# EAGLE design TPS61200 (EAGLE 7.1.0)
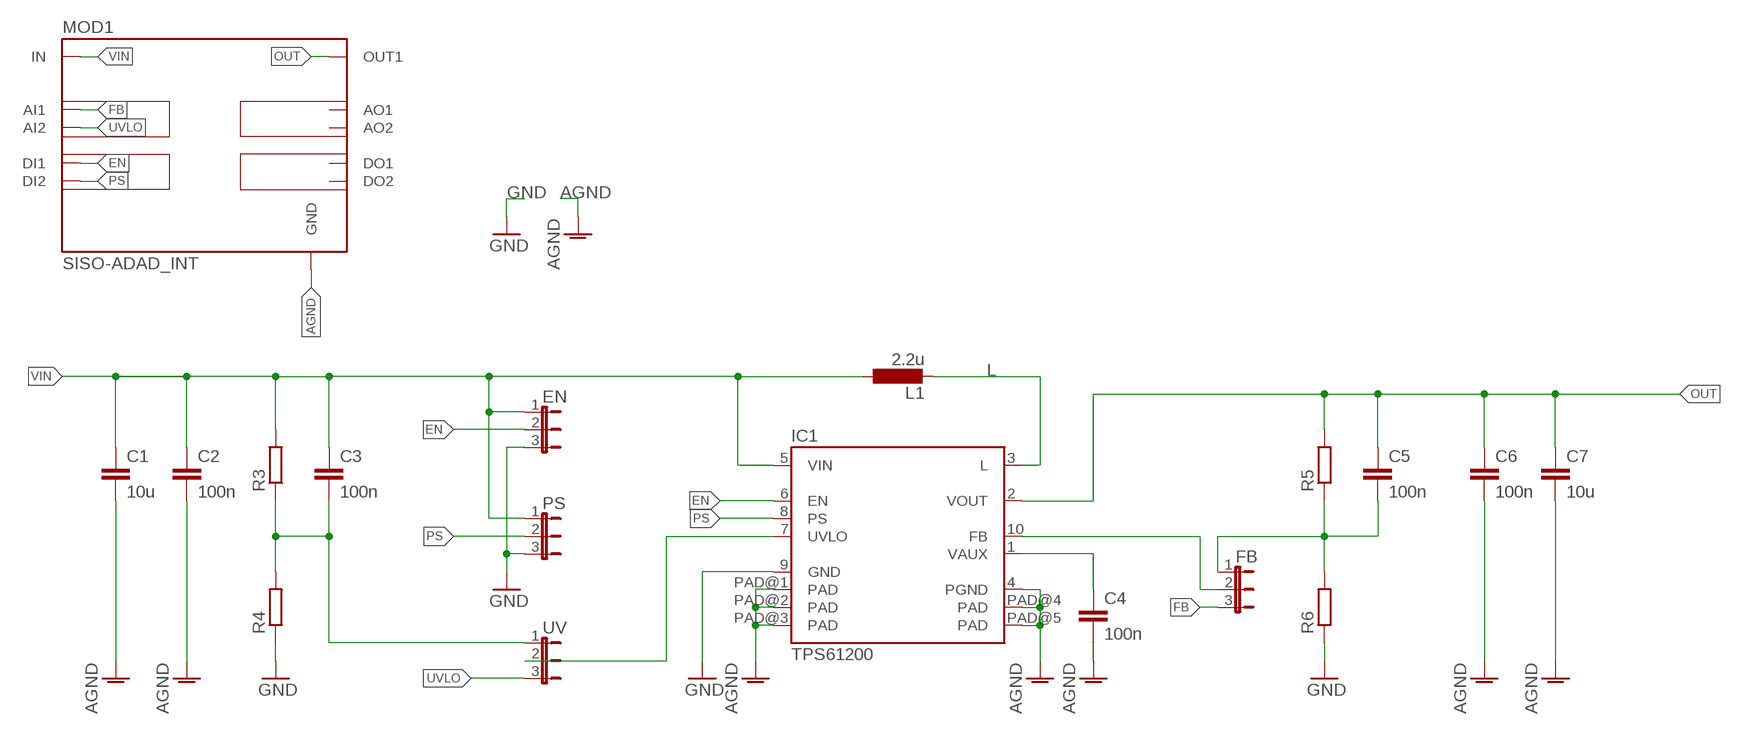
[diagram p0: schematic, sheet 1]

## Parts
C1  10u  C-EUC0805  [C0805]
C2  100n  C-EUC0805  [C0805]
C3  100n  C-EUC0805  [C0805]
C4  100n  C-EUC0805  [C0805]
C5  100n  C-EUC0805  [C0805]
C6  100n  C-EUC0805  [C0805]
C7  10u  C-EUC0805  [C0805]
EN  JP2E  [JP2]
FB  JP2E  [JP2]
IC1  TPS61200  [QFN_10_PAD]
L1  2.2u  L-EUL4035M  [L4035M]
MOD1  SISO-ADAD_INT  [SISO-ADAD]
PS  JP2E  [JP2]
R3  R-EU_R0805  [R0805]
R4  R-EU_R0805  [R0805]
R5  R-EU_R0805  [R0805]
R6  R-EU_R0805  [R0805]
UV  JP2E  [JP2]

## Nets
AGND: C1.2 C2.2 C4.2 C6.2 C7.2 IC1.4(PGND) IC1.PAD@1(PAD) IC1.PAD@2(PAD) IC1.PAD@3(PAD) IC1.PAD@4(PAD) IC1.PAD@5(PAD) MOD1.GND1(GND) MOD1.GND2(GND) MOD1.GND3(GND) MOD1.GND4(GND)
EN: EN.2 IC1.6(EN) MOD1.DI1
FB: FB.3 MOD1.AI1
GND: EN.3 IC1.9(GND) PS.3 R4.1 R6.1
L: IC1.3(L) L1.2
N$1: IC1.7(UVLO) UV.2
N$2: C5.2 FB.1 R5.1 R6.2
N$3: C3.2 R3.1 R4.2 UV.1
N$4: C4.1 IC1.1(VAUX)
N$7: FB.2 IC1.10(FB)
OUT: C5.1 C6.1 C7.1 IC1.2(VOUT) MOD1.OUT1_1(OUT1) MOD1.OUT1_2(OUT1) MOD1.OUT1_3(OUT1) MOD1.OUT1_4(OUT1) R5.2
PS: IC1.8(PS) MOD1.DI2 PS.2
UVLO: MOD1.AI2 UV.3
VIN: C1.1 C2.1 C3.1 EN.1 IC1.5(VIN) L1.1 MOD1.IN1(IN) MOD1.IN2(IN) MOD1.IN3(IN) MOD1.IN4(IN) PS.1 R3.2
Unconnected: MOD1.AO1 MOD1.AO2 MOD1.DO1 MOD1.DO2

## Library data of the parts
C1-C7 = rcl:C-EU: CAPACITOR, European symbol
EN FB PS UV = Jumper_mod:JP2E: JUMPER
IC1 = TPS61200:TPS61200
L1 = rcl:L-EU: INDUCTOR, European symbol
MOD1 = AllModules:SISO-ADAD_INT
R3-R6 = rcl:R-EU_: RESISTOR, European symbol

## Board
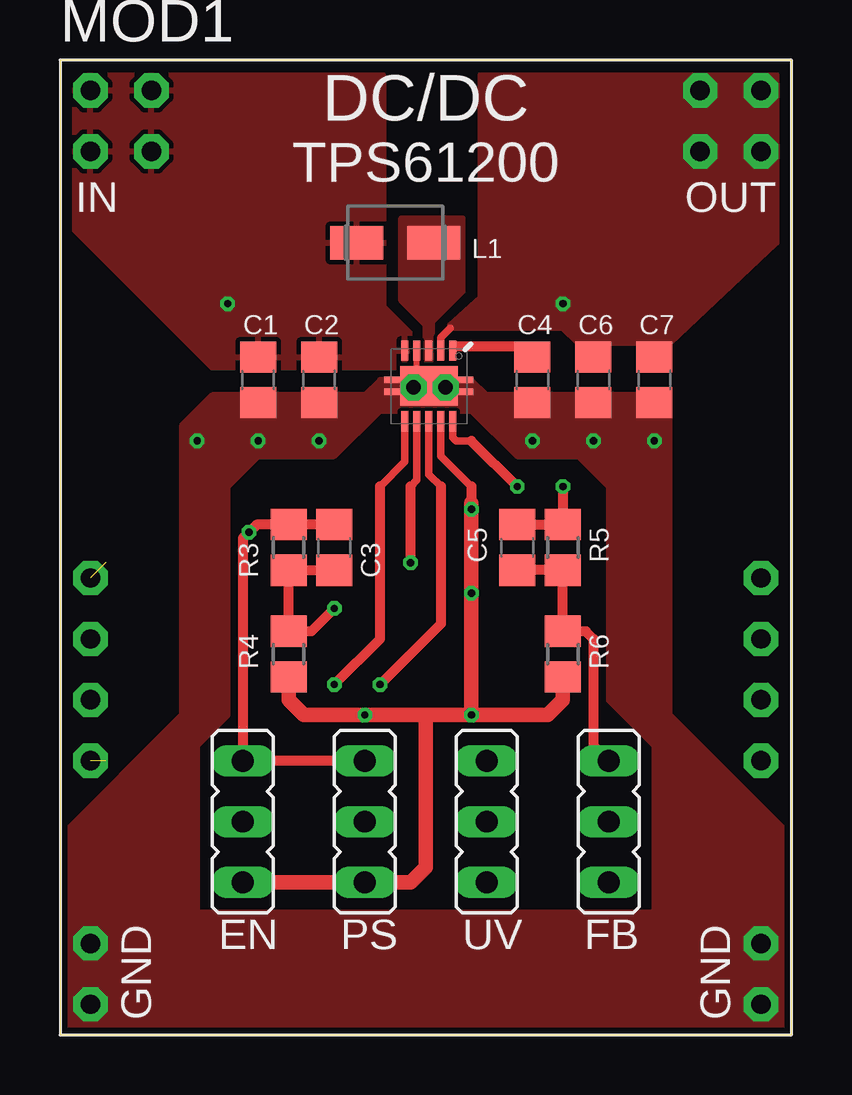
[diagram p1: board, top side]
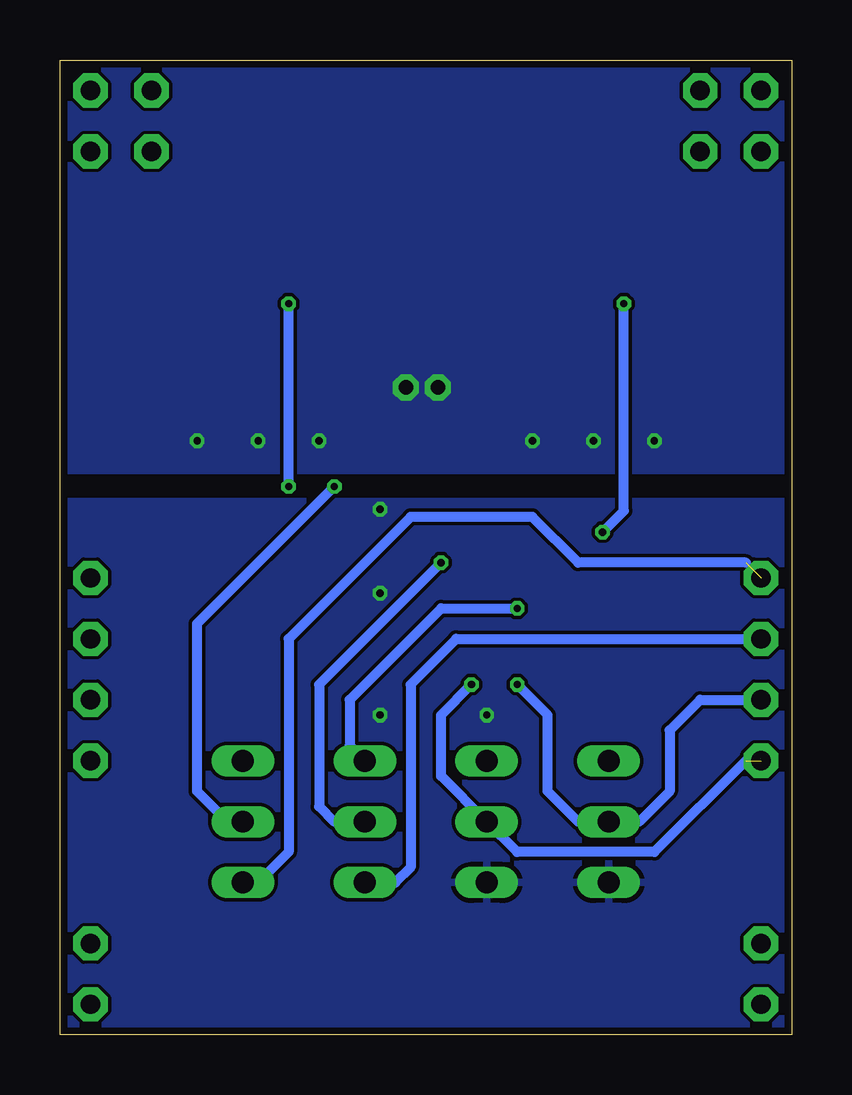
[diagram p2: board, bottom side, seen from below]

Size 30.48 x 40.64 mm. Coordinates in mm from the lower left corner, seen from the top.
Outline: 0,0 30.48,0 30.48,40.64 0,40.64 0,0
Copper layers (1*16): Top 0.035mm / dielectric 1.5mm / Bottom 0.035mm
Design rules "PCB-POOL Standard": minimum track width 0.15mm, minimum drill 0.3mm, track to track 0.15mm, track to pad 0.15mm, pad to pad 0.15mm, via to via 0.15mm, smd to smd 0.15mm, copper to edge 0.3mm, drill to drill 0.2mm, minimum pad ring 0.2mm, minimum via ring 0.15mm, stop-mask expansion 0.075mm, vias tented up to drill 0mil, thermal gap 0.2mm

### Footprints (pad centres in the part's own frame; a part is rotated, then mirrored left to right if it is on the bottom)
C0805 = smd 1.3 x 1.5: 1 -0.95,0; 2 0.95,0
JP2 = drill 0.914 long: 1 -2.54,0; 2 0,0; 3 2.54,0
QFN_10_PAD = smd 0.297 x 0.85: 1 -1,-1.475; 2 -0.5,-1.475; 3 0,-1.475; 4 0.5,-1.475; 5 1,-1.475; 6 1,1.475; 7 0.5,1.475; 8 0,1.475; 9 -0.5,1.475; 10 -1,1.475 | smd 2.4 x 1.65: PAD@1 0,0 | smd 0.7 x 0.28: PAD@2 -1.5,0.25; PAD@3 -1.5,-0.25; PAD@4 1.5,0.25; PAD@5 1.5,-0.25
L4035M = smd 2.2 x 1.4: 1 -1.6,0; 2 1.6,0
SISO-ADAD = drill 0.8 pad 1.422 octagon: AI1 0,-20.32; AI2 0,-22.86; AO1 27.94,-20.32; AO2 27.94,-22.86; DI1 0,-25.4; DI2 0,-27.94; DO1 27.94,-25.4; DO2 27.94,-27.94; GND1 0,-38.1; GND2 0,-35.56; GND3 27.94,-35.56; GND4 27.94,-38.1; IN1 0,0; IN2 0,-2.54; IN3 2.54,0; IN4 2.54,-2.54; OUT1_1 27.94,0; OUT1_2 27.94,-2.54; OUT1_3 25.4,0; OUT1_4 25.4,-2.54
R0805 = smd 1.3 x 1.5: 1 -0.95,0; 2 0.95,0

### Placement (x,y rotation side)
C1  8.26,27.3 270 top
C2  10.79,27.3 270 top
C3  11.43,20.32 270 top
C4  19.68,27.3 270 top
C5  19.05,20.32 270 top
C6  22.23,27.3 270 top
C7  24.77,27.3 270 top
EN  7.62,8.89 270 top
FB  22.86,8.89 270 top
IC1  15.37,27.05 180 top
L1  13.97,33.02 0 top
MOD1  1.27,39.37 0 top
PS  12.7,8.89 270 top
R3  9.53,20.32 90 top
R4  9.53,15.88 90 top
R5  20.95,20.32 90 top
R6  20.95,15.88 90 top
UV  17.78,8.89 270 top

### Tracks (layer width: path | path; a pad name or v marks a point on that pad's centre or on a via)
AGND  (via drill 0.3, 0.6)
  Top 0.254: 14.87,27.25 IC1.4
  Top 0.406: 14.87,27.25 14.87,27.19 14.73,27.05
  other vias: 10.79,24.77 8.26,24.77 19.68,24.77 22.23,24.77 24.77,24.77 16.07,26.99 14.73,26.99 5.71,24.77
  pour Top (no thermals): 0,0 5.71,0 5.71,12.07 6.99,13.34 6.99,22.86 8.26,24.13 11.43,24.13 13.34,26.04 17.14,26.04 19.05,24.13 21.59,24.13 22.86,22.86 22.86,13.97 24.77,12.07 24.77,0 30.48,0 30.48,8.26 25.4,13.34 25.4,26.67 17.78,26.67 17.14,27.3 13.34,27.3 12.7,26.67 6.35,26.67 5.08,25.4 5.08,13.34 0,8.26
  pour Top (no thermals): 0,0 30.48,0 30.48,5.08 0,5.08
  pour Bottom: 0,40.64 30.48,40.64 30.48,23.5 0,23.5
EN  (via drill 0.3)
  Top 0.305: 13.34,22.86 14.37,23.89 IC1.6
  Top 0.406: 13.34,22.86 13.34,16.51 v11.43,14.61
  Bottom 0.406: v11.43,14.61 10.16,13.34 10.16,10.16 8.89,8.89 EN.2 6.35,8.89 5.08,10.16 5.08,12.7 3.81,13.97 MOD1.DI1
FB  (1 unrouted)
  Bottom 0.406: FB.3 22.23,6.35 20.95,7.62 20.95,16.51 15.88,21.59 10.79,21.59 8.89,19.69 1.91,19.69
GND  (via drill 0.3)
  Top 0.305: 17.14,22.86 15.87,24.14 IC1.9
  Top 0.406: 17.14,22.86 17.14,22.16
  Top 0.61: 15.24,13.34 10.16,13.34 9.53,13.97 R4.1 | v17.14,13.34 20.32,13.34 20.95,13.97 R6.1 | 17.14,22.16 v17.14,21.91 v17.14,13.34 | 15.24,13.34 15.24,6.98 14.61,6.35 PS.3 EN.3 | 15.24,13.34 v17.14,13.34
  other vias: 12.7,13.34 17.14,18.41
  pour Bottom: 0,22.23 30.48,22.23 30.48,0 0,0
L
  pour Top (no thermals): 15.24,28.07 15.24,29.59 14.22,30.61 14.22,34.04 16.76,34.04 16.76,30.99 15.49,29.72 15.49,28.07
N$1  (via drill 0.3)
  Top 0.305: 14.61,22.86 14.87,23.12 IC1.7
  Top 0.406: v14.61,19.69 14.61,22.86
  Bottom 0.406: v14.61,19.69 19.68,14.61 19.68,9.53 19.05,8.89 UV.2
N$2
  Top 0.406: C5.2 R5.1 R6.2 21.91,16.82 22.23,16.51 22.23,12.07 FB.1
N$3  (via drill 0.3)
  Top 0.406: C3.2 R3.1 R4.2 10.47,16.82 v11.43,17.78
  Bottom 0.406: v11.43,17.78 14.61,17.78 18.41,13.97 18.41,12.07 UV.1
N$4
  Top 0.305: 16.54,28.7 IC1.1
  Top 0.406: C4.1 19.62,28.26 19.62,28.7 16.54,28.7
N$7  (via drill 0.3)
  Top 0.305: 17.14,24.77 16.51,24.77 16.37,24.91 IC1.10
  Top 0.406: 17.14,24.77 v19.05,22.86
  Bottom 0.406: FB.2 23.5,8.89 24.77,10.16 24.77,17.14 v19.05,22.86
OUT  (via drill 0.3)
  Top 0.305: IC1.2 15.87,29.08 16.26,29.46
  Top 0.406: C5.1 R5.2 v20.95,22.86
  Bottom 0.406: v20.95,22.86 v20.95,30.48
  pour Top (no thermals): 29.84,33.02 25.4,28.83 21.59,28.83 20.95,29.46 16.26,29.46 16.26,29.59 17.53,30.73 17.53,40.01 29.84,40.01
PS  (via drill 0.3)  (1 unrouted)
  Top 0.305: 15.88,22.86 15.37,23.37 IC1.8
  Top 0.406: 15.88,22.86 15.88,17.14 v13.34,14.61
  Bottom 0.406: v13.34,14.61 14.61,13.34 14.61,10.8 PS.2 11.43,7.62 5.71,7.62 1.91,11.43
UVLO
  Bottom 0.406: UV.3 16.51,6.35 15.88,6.98 15.88,14.61 13.97,16.51 MOD1.AI2
VIN  (via drill 0.3)
  Top 0.406: PS.1 EN.1 7.62,20.7 v7.87,20.96 8.19,21.27 C3.1 R3.2
  Bottom 0.406: v6.99,30.48 6.99,21.84 v7.87,20.96
  pour Top: 14.61,27.81 6.35,27.81 0.64,33.53 0.64,40.01 13.46,40.01 13.46,30.35 14.61,29.21

### Text on the board
tNames: DC/DC | TPS61200
bStop: by J. Kokert 12.03.2015